# Altium schematic sheet RGB_LED.SchDoc
size A; SheetNumber: 7; SheetTotal: 7
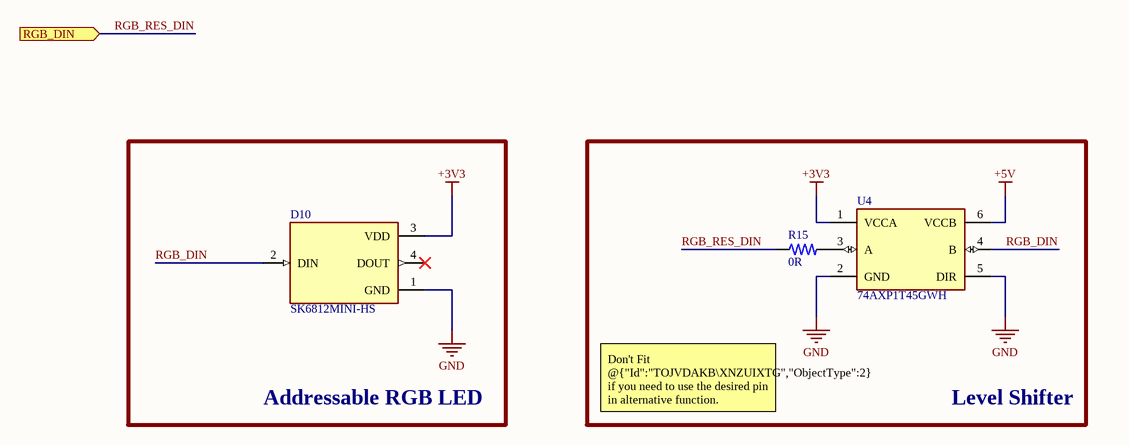
[diagram p0: RGB_LED.SchDoc]

## Parts
D10  SK6812MINI-HS  [LED_SK6812MINI-HS]
R15  0R  [0402 RES]
U4  74AXP1T45GWH  [SOT65P210X110-6N]

## Blocks framed on the sheet
Addressable RGB LED: D10
Level Shifter: R15 U4

## Ports
RGB_DIN (in, see Master[2C])

## Nets
+3V3: D10.3(VDD) U4.1(VCCA)
+5V: U4.6(VCCB)
GND: D10.1(GND) U4.2(GND) U4.5(DIR)
RGB_DIN: D10.2(DIN) U4.4(B)
RGB_RES_DIN: R15.1 ; port RGB_DIN
NetR15_2: R15.2 U4.3(A)

Not connected (* = marked no-connect by the designer): D10 4(DOUT)*

## Notes on the sheet
- Don't Fit @{"Id":"TOJVDAKB\XNZUIXTG","ObjectType":2} if you need to use the desired pin in alternative function.

## Library data of the parts
D10 = SK6812MINI-HS: INTEGRATED LIGHT SOURCE INTELLIGENT CONTROL OF CHIP-ON-TOP SMD TYPE LED; MF: DONGGUANG OPSCO OPTOELECTRONICS CO., LTD; MP: SK6812MINI-012; SnapEDA_Link: https://www.snapeda.com/parts/SK6812MINI-012/DONGGUANG+OPSCO+OPTOELECTRONICS+CO.%252C+LTD/view-part/?ref=snap; Package: Package; Value: *; Check_prices: https://www.snapeda.com/parts/SK6812MINI-012/DONGGUANG+OPSCO+OPTOELECTRONICS+CO.%252C+LTD/view-part/?ref=eda
R15 = 0402 SMD Resistor: SMD Chip Resistor, Jumper, 0 ohm, 100 mW, 0402 [1005 Metric], Thick Film, General Purpose; Manufacturer: Panasonic; Manufacturer Part Number: ERJ-2GE0R00X; Value: 0mR; Power Rating: 100mW; Voltage Rating: 50V; Temperature Coefficient: 600ppm/°C; ComponentLink1Description: Link; ComponentLink1URL: *; Supplier: Mouser; Supplier Part Number: 667-ERJ-2GE0R00X; RoHS: Yes; Category: Chip SMD Resistors; Stock: 616486; Pricing: 1=0.1, 10=0.013, 50=0.013, 100=0.008, 1000=0.006, 10000=0.004 (USD); Mounting Technology: Surface Mount; Case/Package: 0402; Pins: 2NUMBER; Contact Plating: Tin; Case Code (Metric): 1005; Case Code (Imperial): 0402; Min Operating Temperature: -55°C; Max Operating Temperature: 155°C; Resistor Type: Thick Film; Packaging: Cut Tape; Package Quantity: 10000; Number of Terminations: 2; Termination: SMD/SMT; Max Power Dissipation: 100mW; Features: Automotive AEC-Q200; Series: ERJ; Construction: Rectangular; Technology: THICK FILM; Voltage Rating (DC): 50V; Length: 1mm; Width: 0.5mm; Height: 0.35mm; Depth: 0.5mm; Ratings: AEC-Q200; Radiation Hardening: No; Reach SVHC Compliant: No; Military Standard: Not; RoHS Compliant: Yes; Lead Free: 5697LeadFree; ComponentLink2URL: https://datasheet.ciiva.com/11821/0900766b80f806dd-11821176.pdf?src-supplier=Rs; ComponentLink2Description: https://datasheet.ciiva.com/11821/0900766b80f806dd-11821176.pdf?src-supplier=Rs; ComponentLink3URL: https://datasheet.ciiva.com/46389/1678796-46389518.pdf?src-supplier=Element14; ComponentLink3Description: https://datasheet.ciiva.com/46389/1678796-46389518.pdf?src-supplier=Element14; ComponentLink4URL: https://datasheet.ciiva.com/28695/1678796-28695758.pdf?src-supplier=Element14; ComponentLink4Description: https://datasheet.ciiva.com/28695/1678796-28695758.pdf?src-supplier=Element14; ComponentLink5URL: https://datasheet.ciiva.com/16778/70260739-16778335.pdf?src-supplier=Allied+Electronics; ComponentLink5Description: https://datasheet.ciiva.com/16778/70260739-16778335.pdf?src-supplier=Allied+Electronics; ComponentLink6URL: https://datasheet.ciiva.com/48531/aoa0000ce1-48531077.pdf?src-supplier=Avnet; ComponentLink6Description: https://datasheet.ciiva.com/48531/aoa0000ce1-48531077.pdf?src-supplier=Avnet; ComponentLink7URL: https://datasheet.ciiva.com/30097/4aoa0000ce1-30097116.pdf?src-supplier=Onlinecomponents.com; ComponentLink7Description: https://datasheet.ciiva.com/30097/4aoa0000ce1-30097116.pdf?src-supplier=Onlinecomponents.com; ComponentLink8URL: https://datasheet.ciiva.com/43460/1678796-43460347.pdf?src-supplier=Farnell; ComponentLink8Description: https://datasheet.ciiva.com/43460/1678796-43460347.pdf?src-supplier=Farnell; ComponentLink9URL: https://datasheet.ciiva.com/5959/1678796-5959692.pdf?src-supplier=Farnell; ComponentLink9Description: https://datasheet.ciiva.com/5959/1678796-5959692.pdf?src-supplier=Farnell; ComponentLink10URL: https://datasheet.ciiva.com/16783/70260739-16783734.pdf?src-supplier=Allied+Electronics; ComponentLink10Description: https://datasheet.ciiva.com/16783/70260739-16783734.pdf?src-supplier=Allied+Electronics
U4 = 74AXP1T45GWH: Voltage Level Translator Bidirectional 1 Circuit 1 Channel - 6-TSSOP; MF: Nexperia; Check_prices: https://www.snapeda.com/parts/74AXP1T45GWH/Nexperia/view-part/?ref=eda; Value: *; Availability: In Stock; Price: None; Package: TSSOP6-6 Nexperia USA Inc.; MP: 74AXP1T45GWH; SnapEDA_Link: https://www.snapeda.com/parts/74AXP1T45GWH/Nexperia/view-part/?ref=snap; Purchase-URL: https://pricing.snapeda.com/search/part/74AXP1T45GWH/?ref=eda